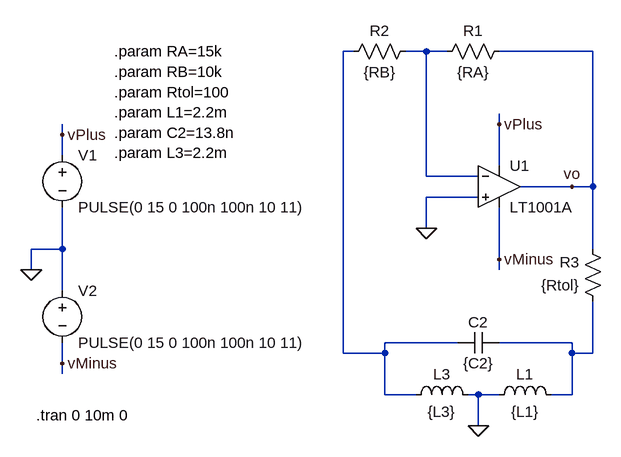
[diagram p0: schematic HartleyReal.asc]
HartleyReal.asc, the LTspice schematic file:
Version 4
SHEET 1 880 680
WIRE 128 -128 112 -128
WIRE 240 -128 208 -128
WIRE 272 -128 240 -128
WIRE 496 -128 352 -128
WIRE 352 -16 352 -32
WIRE -320 0 -320 -16
WIRE -320 32 -320 0
WIRE 352 48 352 -16
WIRE 240 64 240 -128
WIRE 320 64 240 64
WIRE 464 80 384 80
WIRE 496 80 496 -128
WIRE 496 80 464 80
WIRE 320 96 240 96
WIRE 240 144 240 96
WIRE -320 176 -320 112
WIRE -320 176 -368 176
WIRE 496 176 496 80
WIRE 352 192 352 112
WIRE -368 208 -368 176
WIRE 352 208 352 192
WIRE -320 240 -320 176
WIRE 288 320 176 320
WIRE 464 320 352 320
WIRE 112 336 112 -128
WIRE 176 336 176 320
WIRE 176 336 112 336
WIRE 464 336 464 320
WIRE 496 336 496 256
WIRE 496 336 464 336
WIRE -320 352 -320 320
WIRE -320 368 -320 352
WIRE 176 400 176 336
WIRE 224 400 176 400
WIRE 320 400 304 400
WIRE 352 400 320 400
WIRE 464 400 464 336
WIRE 464 400 432 400
WIRE 320 448 320 400
FLAG -368 208 0
FLAG -320 0 vPlus
FLAG -320 352 vMinus
FLAG 352 -16 vPlus
FLAG 352 192 vMinus
FLAG 464 80 vo
FLAG 320 448 0
FLAG 240 144 0
SYMBOL Opamps\\LT1001A 352 16 R0
SYMATTR InstName U1
SYMBOL voltage -320 16 R0
WINDOW 123 0 0 Left 2
WINDOW 39 0 0 Left 2
SYMATTR InstName V1
SYMATTR Value PULSE(0 15 0 100n 100n 10 11)
SYMBOL voltage -320 224 R0
WINDOW 123 0 0 Left 2
WINDOW 39 0 0 Left 2
SYMATTR InstName V2
SYMATTR Value PULSE(0 15 0 100n 100n 10 11)
SYMBOL res 368 -144 R90
WINDOW 0 0 56 VBottom 2
WINDOW 3 32 56 VTop 2
SYMATTR InstName R1
SYMATTR Value {RA}
SYMBOL res 224 -144 R90
WINDOW 0 0 56 VBottom 2
WINDOW 3 32 56 VTop 2
SYMATTR InstName R2
SYMATTR Value {RB}
SYMBOL cap 352 304 R90
WINDOW 0 0 32 VBottom 2
WINDOW 3 32 32 VTop 2
SYMATTR InstName C2
SYMATTR Value {C2}
SYMBOL res 512 272 R180
WINDOW 0 36 76 Left 2
WINDOW 3 36 40 Left 2
SYMATTR InstName R3
SYMATTR Value {Rtol}
SYMBOL ind 336 416 R270
WINDOW 0 32 56 VTop 2
WINDOW 3 5 56 VBottom 2
SYMATTR InstName L1
SYMATTR Value {L1}
SYMBOL ind 208 416 R270
WINDOW 0 32 56 VTop 2
WINDOW 3 5 56 VBottom 2
SYMATTR InstName L3
SYMATTR Value {L3}
TEXT -360 432 Left 2 !.tran 0 10m 0
TEXT -240 -128 Left 2 !.param RA=15k\n.param RB=10k\n.param Rtol=100\n.param L1=2.2m\n.param C2=13.8n \n.param L3=2.2m

The netlist it stands for:
* HartleyReal.asc
XU1 0 N002 vPlus vMinus vo LT1001  ; LT1001A, pins In+ In- V+ V- OUT
V1 vPlus 0 PULSE(0 15 0 100n 100n 10 11)
V2 0 vMinus PULSE(0 15 0 100n 100n 10 11)
R1 vo N002 {RA}
R2 N002 N001 {RB}
C2 N003 N001 {C2}
R3 N003 vo {Rtol}
L1 0 N003 {L1}
L3 N001 0 {L3}
.tran 0 10m 0
.param RA=15k
.param RB=10k
.param Rtol=100
.param L1=2.2m
.param C2=13.8n
.param L3=2.2m
.lib LTC.lib
.backanno
.end